# EAGLE design psu_board (EAGLE 7.6.0)
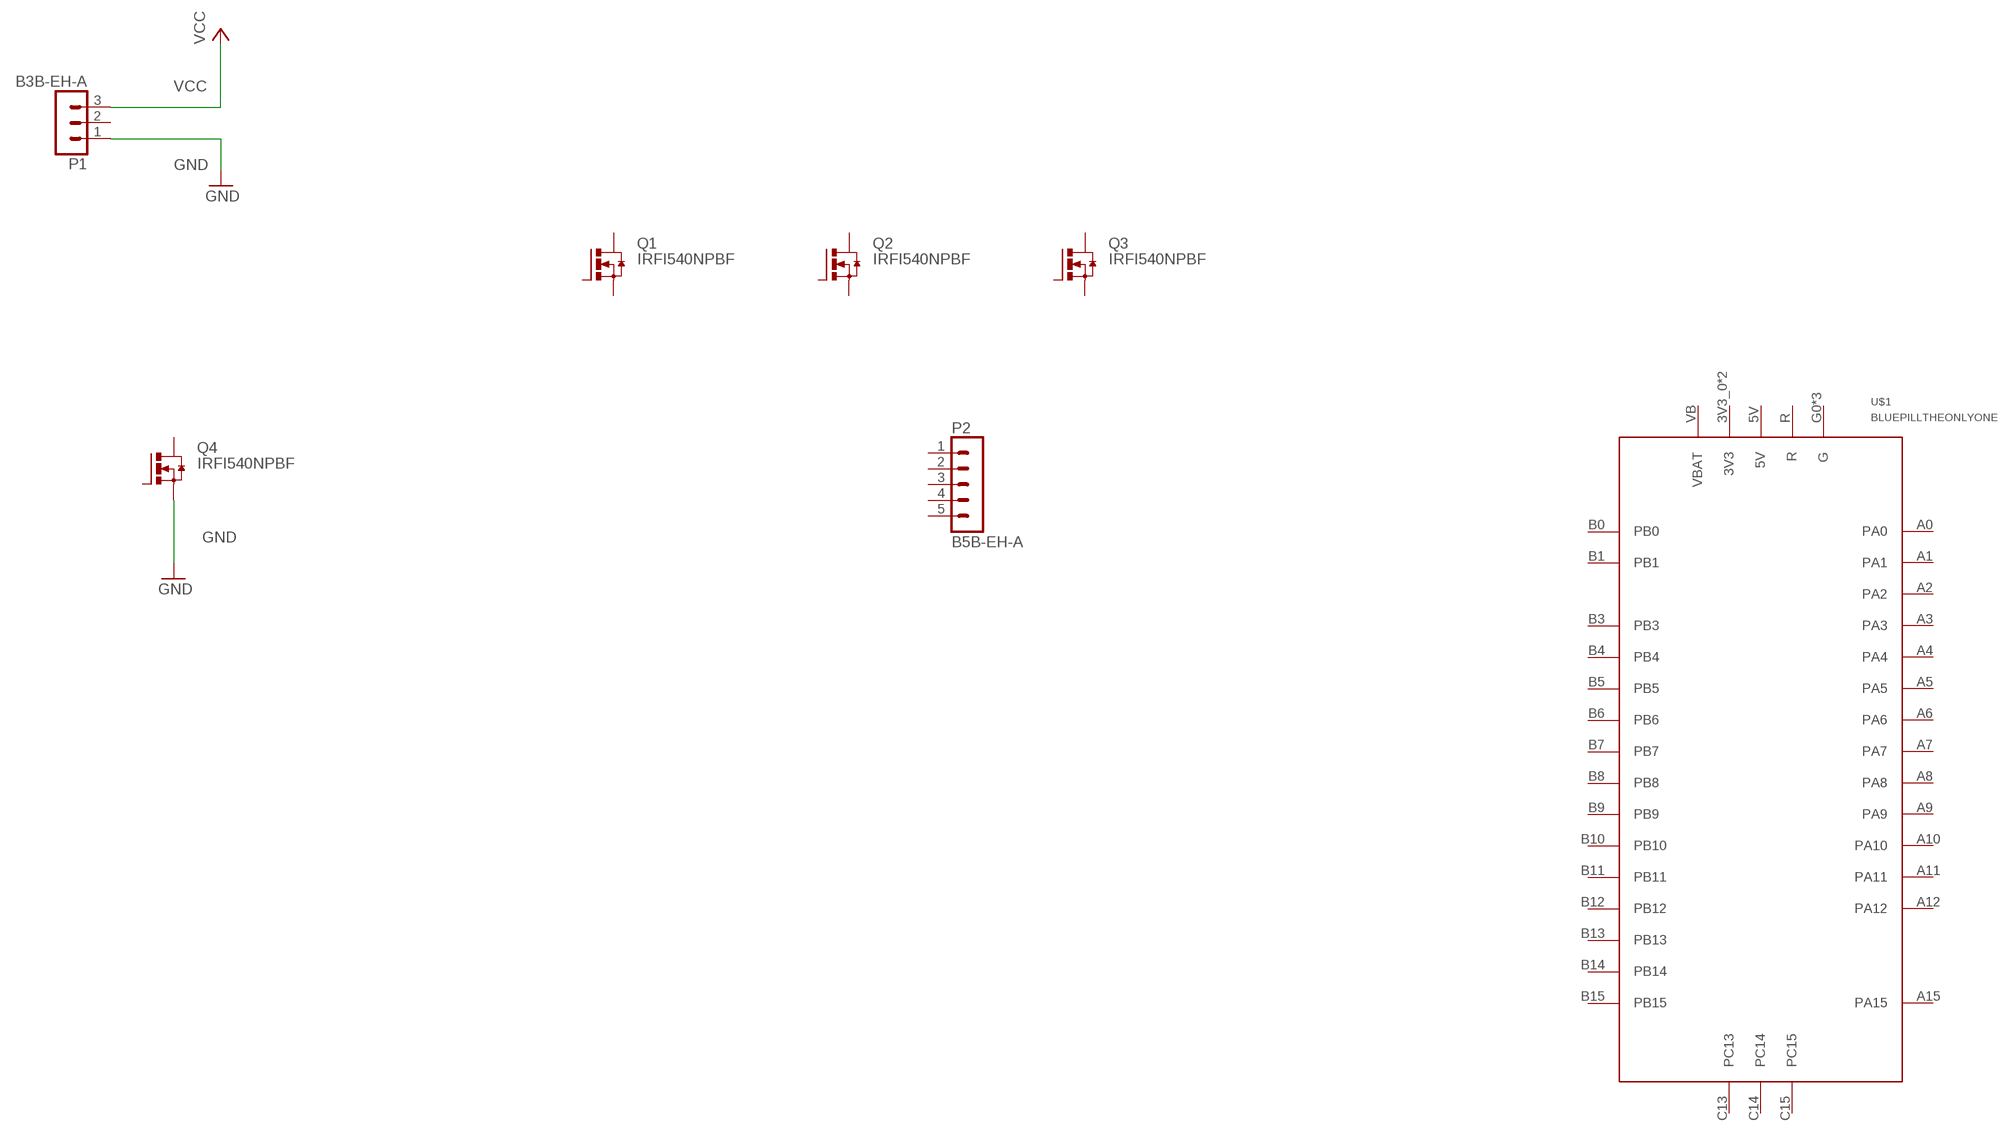
[diagram p0: schematic, sheet 1]

## Parts
P1  B3B-EH-A  [B3B-EH-A]
P2  B5B-EH-A  [B5B-EH-A]
Q1  IRFI540NPBF  [TO220BH]
Q2  IRFI540NPBF  [TO220BH]
Q3  IRFI540NPBF  [TO220BH]
Q4  IRFI540NPBF  [TO220BH]
U$1  BLUEPILLTHEONLYONE  [BLUEPIL]

## Nets
GND: P1.1 Q4.S
VCC: P1.3
Unconnected: P1.2 P2.1 P2.2 P2.3 P2.4 P2.5 Q1.D Q1.G Q1.S Q2.D Q2.G Q2.S Q3.D Q3.G Q3.S Q4.D Q4.G U$1.3V3_0(3V3) U$1.3V3_1(3V3) U$1.5V U$1.A0 U$1.A1 U$1.A2 U$1.A3 U$1.A4 U$1.A5 U$1.A6 U$1.A7 U$1.A8 U$1.A9 U$1.A10 U$1.A11 U$1.A12 U$1.A15 U$1.B0 U$1.B1 U$1.B3 U$1.B4 U$1.B5 U$1.B6 U$1.B7 U$1.B8 U$1.B9 U$1.B10 U$1.B11 U$1.B12 U$1.B13 U$1.B14 U$1.B15 U$1.C13 U$1.C14 U$1.C15 U$1.G0(G) U$1.G1(G) U$1.G2(G) U$1.R U$1.VB(VBAT)

## Library data of the parts
P1 = con-jst-eh:B3B-EH-A: HEADER
P2 = con-jst-eh:B5B-EH-A: HEADER
Q1-Q4 = transistor-power:IRFI540NPBF: HEXFET Power MOISFET VDSS = 100V, RDS(on) = 0.052 Ohm, ID = 20A, VGS(th) = 2.0 -- 4.0V Source: http://www.irf.com/product-info/datasheets/data/irfi540npbf.pdf
U$1 = bluepill:BLUEPILL: BLUEPILL

## Board
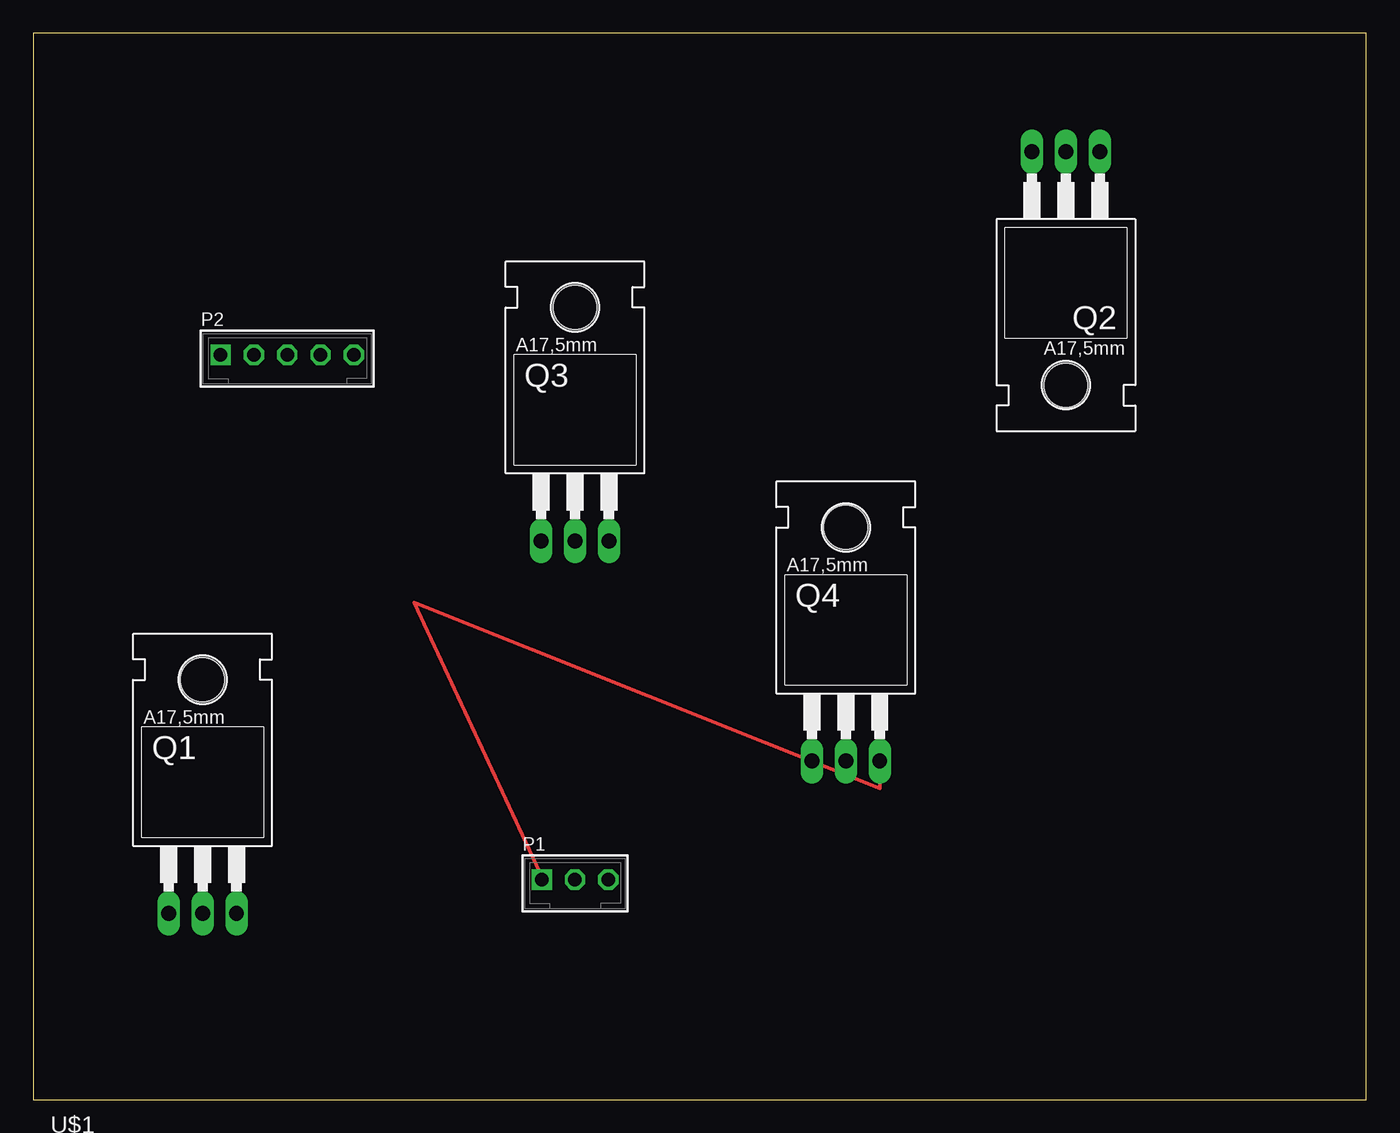
[diagram p1: board, top side]

Size 100 x 80 mm. Coordinates in mm from the lower left corner, seen from the top.
Outline: 0,0 100,0 100,80 0,80 0,0
Copper layers (1*16): Top 0.035mm / dielectric 1.5mm / Bottom 0.035mm
Design rules "default": minimum track width 10mil, minimum drill 24mil, track to track 8mil, track to pad 8mil, pad to pad 8mil, via to via 8mil, smd to smd 8mil, copper to edge 40mil, drill to drill 8mil, minimum pad ring 10mil, minimum via ring 8mil, stop-mask expansion 4mil, vias tented up to drill 0mil, thermal gap 10mil

### Footprints (pad centres in the part's own frame; a part is rotated, then mirrored left to right if it is on the bottom)
B3B-EH-A = drill 1.016 square: 1 -2.5,0 | drill 1.016 octagon: 2 0,0; 3 2.5,0
B5B-EH-A = drill 1.016 square: 1 -5,0 | drill 1.016 octagon: 2 -2.5,0; 3 0,0; 4 2.5,0; 5 5,0
TO220BH = drill 1.118 long: D 0,-6.35; G -2.54,-6.35; S 2.54,-6.35 | hole 3.302: 0,11.176
BLUEPIL = drill 0.8 long: 3V3_0 -19.05,7.62; 3V3_1 24.13,-7.62; 5V 19.05,-7.62; A0 13.97,7.62; A1 11.43,7.62; A2 8.89,7.62; A3 6.35,7.62; A4 3.81,7.62; A5 1.27,7.62; A6 -1.27,7.62; A7 -3.81,7.62; A8 -13.97,-7.62; A9 -11.43,-7.62; A10 -8.89,-7.62; A11 -6.35,-7.62; A12 -3.81,-7.62; A15 -1.27,-7.62; B0 -6.35,7.62; B1 -8.89,7.62; B3 1.27,-7.62; B4 3.81,-7.62; B5 6.35,-7.62; B6 8.89,-7.62; B7 11.43,-7.62; B8 13.97,-7.62; B9 16.51,-7.62; B10 -11.43,7.62; B11 -13.97,7.62; B12 -24.13,-7.62; B13 -21.59,-7.62; B14 -19.05,-7.62; B15 -16.51,-7.62; C13 21.59,7.62; C14 19.05,7.62; C15 16.51,7.62; G0 -24.13,7.62; G1 -21.59,7.62; G2 21.59,-7.62; R -16.51,7.62; VB 24.13,7.62

### Placement (x,y rotation side)
P1  40.64,16.51 0 top
P2  19.05,55.88 0 top
Q1  12.7,20.32 0 top
Q2  77.47,64.77 180 top
Q3  40.64,48.26 0 top
Q4  60.96,31.75 0 top
U$1  27.94,-15.24 0 top  (outside the outline)

### Tracks (layer width: path | path; a pad name or v marks a point on that pad's centre or on a via)
GND
  Top 0.254: Q4.S 63.5,23.34 28.57,37.31 38.26,16.51 P1.1